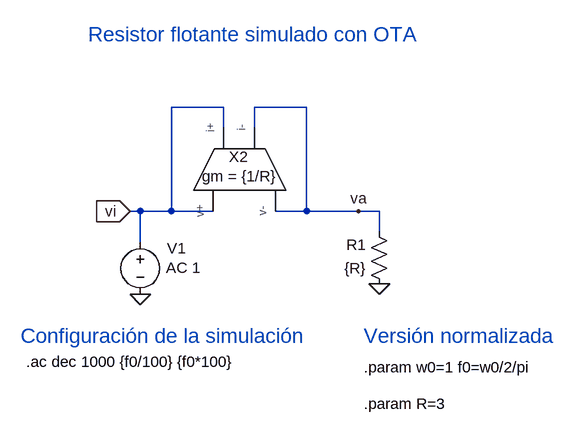
[diagram p0: schematic OTA R flotante simulada.asc]
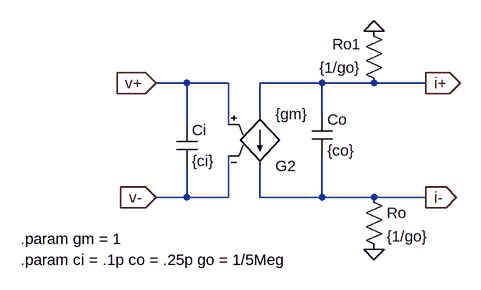
[diagram p1: sub-circuit ota_diff.asc]
OTA R flotante simulada.asc, the LTspice schematic file:
Version 4
SHEET 1 944 880
WIRE 304 -32 224 -32
WIRE 432 -32 352 -32
WIRE 304 0 304 -32
WIRE 352 0 352 -32
WIRE 176 128 160 128
WIRE 224 128 224 -32
WIRE 224 128 176 128
WIRE 288 128 224 128
WIRE 432 128 384 128
WIRE 432 128 432 -32
WIRE 512 128 432 128
WIRE 544 128 512 128
WIRE 544 160 544 128
WIRE 176 176 176 128
FLAG 176 256 0
FLAG 160 128 vi
IOPIN 160 128 In
FLAG 544 240 0
FLAG 512 128 va
SYMBOL res 560 256 R180
WINDOW 0 36 76 Left 2
WINDOW 3 36 40 Left 2
SYMATTR InstName R1
SYMATTR Value {R}
SYMBOL voltage 176 160 R0
WINDOW 123 40 55 Left 2
WINDOW 39 0 0 Left 0
WINDOW 0 41 25 Left 2
SYMATTR Value2 AC 1
SYMATTR InstName V1
SYMATTR Value ""
SYMBOL OTA_diff 336 48 R270
WINDOW 0 -12 -9 VTop 2
WINDOW 39 -42 -7 VTop 2
SYMATTR InstName X2
SYMATTR SpiceLine gm = {1/R}
TEXT 0 360 Left 2 !.ac dec 1000 {f0/100} {f0*100}
TEXT 520 424 Left 2 !.param R=3
TEXT -8 320 Left 3 ;Configuración de la simulación
TEXT 520 320 Left 3 ;Versión normalizada
TEXT 520 368 Left 2 !.param w0=1 f0=w0/2/pi
TEXT 96 -144 Left 3 ;Resistor flotante simulado con OTA

ota_diff.asc, the sub-circuit schematic file:
Version 4
SHEET 1 880 680
WIRE -16 80 -64 80
WIRE 48 80 -16 80
WIRE 192 80 96 80
WIRE 272 80 192 80
WIRE 352 80 272 80
WIRE 96 128 96 80
WIRE 192 128 192 80
WIRE -16 144 -16 80
WIRE 48 144 48 80
WIRE -16 256 -16 208
WIRE -16 256 -64 256
WIRE 48 256 48 192
WIRE 48 256 -16 256
WIRE 96 256 96 208
WIRE 192 256 192 192
WIRE 192 256 96 256
WIRE 272 256 192 256
WIRE 352 256 272 256
FLAG 352 80 i+
IOPIN 352 80 Out
FLAG 352 256 i-
IOPIN 352 256 Out
FLAG -64 80 v+
IOPIN -64 80 In
FLAG -64 256 v-
IOPIN -64 256 In
FLAG 272 336 0
FLAG 272 0 0
SYMBOL cap -32 144 R0
SYMATTR InstName Ci
SYMATTR Value {ci}
SYMBOL cap 176 128 R0
SYMATTR InstName Co
SYMATTR Value {co}
SYMBOL res 256 240 R0
SYMATTR InstName Ro
SYMATTR Value {1/go}
SYMBOL g2 96 224 M180
SYMATTR InstName G2
SYMATTR Value {gm}
SYMBOL res 288 96 R180
WINDOW 0 36 76 Left 2
WINDOW 3 36 40 Left 2
SYMATTR InstName Ro1
SYMATTR Value {1/go}
TEXT -272 320 Left 2 !.param gm = 1
TEXT -272 352 Left 2 !.param ci = .1p co = .25p go = 1/5Meg

The netlist it stands for:
* OTA R flotante simulada.asc
R1 0 va {R}
V1 vi 0 AC 1
XX2 va vi vi va ota_diff params: gm = {1/R}

* block symbol definitions
.subckt ota_diff i- i+ v+ v-
Ci v+ v- {ci}
Co i+ i- {co}
Ro i- 0 {1/go}
G2 i+ i- v+ v- {gm}
Ro1 i+ 0 {1/go}
.param gm = 1
.param ci = .1p co = .25p go = 1/5Meg
.ends ota_diff

.ac dec 1000 {f0/100} {f0*100}
.param R=3
* Configuración de la simulación
* Versión normalizada
.param w0=1 f0=w0/2/pi
* Resistor flotante simulado con OTA
.backanno
.end